# EAGLE design AFM_QFM_input_patial (EAGLE 9.6.2)
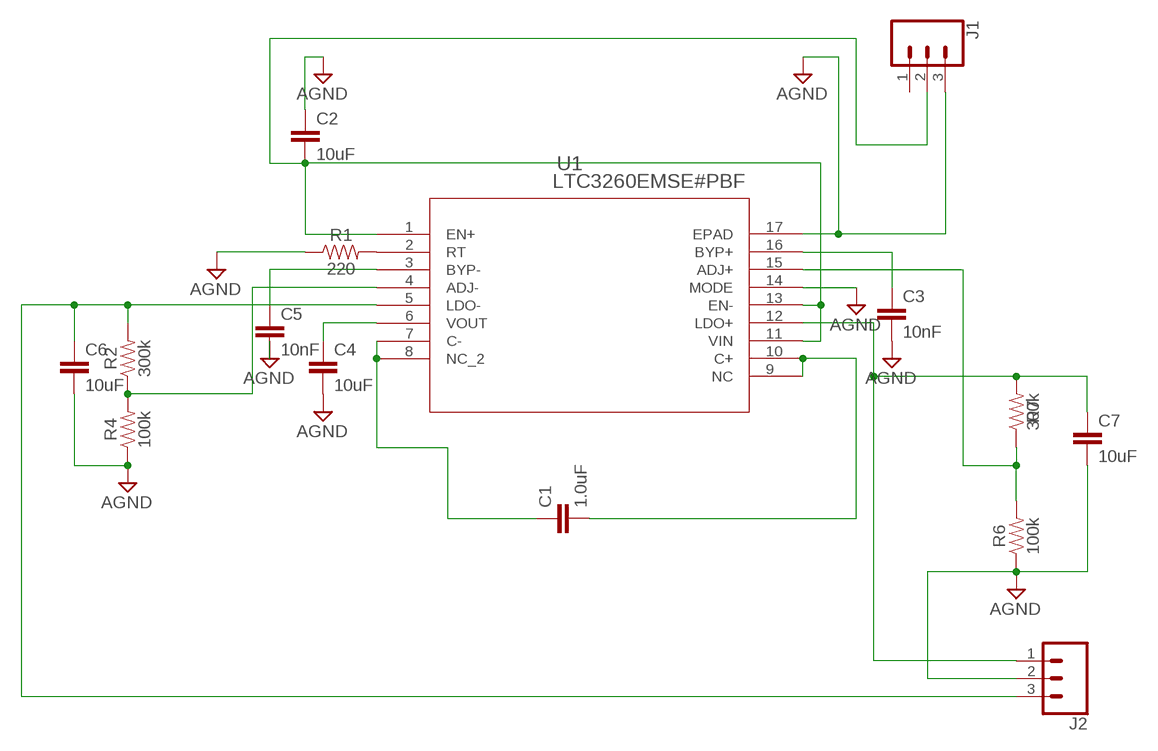
[diagram p0: schematic, sheet 1]

## Parts
C1  1.0uF  1.0UF-0805-25V-(+80/-20%)  [0805]
C2  10uF  10UF-0805-25V-10%  [0805]
C3  10nF  10NF-0603-50V-10%  [0603]
C4  10uF  10UF-0805-25V-10%  [0805]
C5  10nF  10NF-0603-50V-10%  [0603]
C6  10uF  10UF-0805-25V-10%  [0805]
C7  10uF  10UF-0805-25V-10%  [0805]
J1  CONN_03LONGPADS  [1X03_LONGPADS]
J2  CONN_03LONGPADS  [1X03_LONGPADS]
R1  220  220OHM-0603-1/10W-1%  [0603]
R2  300k  300KOHM-0603-1/10W-1%  [0603]
R4  100k  100KOHM-0603-1/10W-1%  [0603]
R6  100k  100KOHM-0603-1/10W-1%  [0603]
R7  300k  300KOHM-0603-1/10W-1%  [0603]
U1  LTC3260EMSE#PBF  [MSOP-16_MSE]

## Nets
AGND: C2.1 C3.2 C4.2 C5.2 C6.2 C7.2 J1.3 J2.2 R1.1 R4.1 R6.1 U1.14(MODE) U1.17(EPAD)
N$1: C5.1 U1.3(BYP-)
N$2: R1.2 U1.2(RT)
N$3: C1.1 U1.7(C-) U1.8(NC_2)
N$4: C1.2 U1.9(NC) U1.10(C+)
N$5: C2.2 J1.2 U1.1(EN+) U1.11(VIN) U1.13(EN-)
N$6: C3.1 U1.16(BYP+)
N$7: C4.1 U1.6(VOUT)
N$8: R2.1 R4.2 U1.4(ADJ-)
N$10: C6.1 J2.3 R2.2 U1.5(LDO-)
N$12: R6.2 R7.1 U1.15(ADJ+)
N$13: C7.1 J2.1 R7.2 U1.12(LDO+)
Unconnected: J1.1

## Library data of the parts
C1 = SparkFun-Capacitors:1.0UF: 1µF ceramic capacitors A capacitor is a passive two-terminal electrical component used to store electrical energy temporarily in an electric field.; PROD_ID: CAP-11625
C2 C4 C6 C7 = SparkFun-Capacitors:10UF: 10.0µF ceramic capacitors A capacitor is a passive two-terminal electrical component used to store electrical energy temporarily in an electric field.; PROD_ID: CAP-14259
C3 C5 = SparkFun-Capacitors:10NF: 0.01uF/10nF/10,000pF ceramic capacitors A capacitor is a passive two-terminal electrical component used to store electrical energy temporarily in an electric field. CAP-09321; PROD_ID: CAP-00867
J1 J2 = SparkFun-Connectors:CONN_03: Multi connection point. Often used as Generic Header-pin footprint for 0.1 inch spaced/style header connections On any of the 0.1 inch spaced packages, you can populate with these: Break Away Headers - Straight <https://www.sparkfun.com/products/116> (PRT-00116) Break Away Male Headers - Right Angle <https://www.sparkfun.com/products/553> (PRT-00553) Female Headers <https://www.sparkfun.com/products/115> (PRT-00115) Break Away Headers - Machine Pin <https://www.sparkfun.com/products/117> (PRT-00117) Break Away Female Headers - Swiss Machine Pin <https://www.sparkfun.com/products/743> (PRT-00743) Stackable Header - 3 Pin (Female, 0.1") <https://www.sparkfun.com/products/13875> (PRT-13875) For SCREWTERMINALS and SPRING TERMINALS visit here: Screw Terimnals on SparkFun.com <https://www.sparkfun.com/search/results?term=Screw+Terminals> (5mm/3.5mm/2.54mm spacing) This device is also useful as a general connection point to wire up your design to another part of your project. Our various solder wires solder well into these plated through hole pads. Hook-Up Wire - Assortment (Stranded, 22 AWG) <https://www.sparkfun.com/products/11375> (PRT-11375) Hook-Up Wire - Assortment (Solid Core, 22 AWG) <https://www.sparkfun.com/products/11367> (PRT-11367) View the entire wire category on our website here <https://www.sparkfun.com/categories/141> Special notes: Molex polarized connector foot print use with SKU : PRT-08232 with associated crimp pins and housings.
R1 = SparkFun-Resistors:220OHM: 220Ω resistor A resistor is a passive two-terminal electrical component that implements electrical resistance as a circuit element. Resistors act to reduce current flow, and, at the same time, act to lower voltage levels within circuits. - Wikipedia; PROD_ID: RES-07861
R2 R7 = SparkFun-Resistors:300KOHM: 300kΩ resistor A resistor is a passive two-terminal electrical component that implements electrical resistance as a circuit element. Resistors act to reduce current flow, and, at the same time, act to lower voltage levels within circuits. - Wikipedia; PROD_ID: RES-10809
R4 R6 = SparkFun-Resistors:100KOHM: 100kΩ resistor A resistor is a passive two-terminal electrical component that implements electrical resistance as a circuit element. Resistors act to reduce current flow, and, at the same time, act to lower voltage levels within circuits. - Wikipedia; PROD_ID: RES-07828
U1 = LTC3260EMSE_PBF (1):LTC3260EMSE#PBF: Check availability <https://pricing.snapeda.com/parts/LTC3260EMSE%23PBF/Analog%20Devices/view-part?ref=eda>; AVAILABILITY: In Stock; CHECK_PRICES: https://www.snapeda.com/parts/LTC3260EMSE%23PBF/Analog+Devices/view-part/?ref=eda; DESCRIPTION: Low Noise Dual Supply Inverting Charge Pump; MF: Analog Devices; MP: LTC3260EMSE#PBF; PACKAGE: MSOP -16 Analog Devices; PRICE: None; PURCHASE-URL: https://www.snapeda.com/api/url_track_click_mouser/?unipart_id=4339513&manufacturer=Analog Devices&part_name=LTC3260EMSE#PBF&search_term=None; SNAPEDA_LINK: https://www.snapeda.com/parts/LTC3260EMSE%23PBF/Analog+Devices/view-part/?ref=snap

## Board
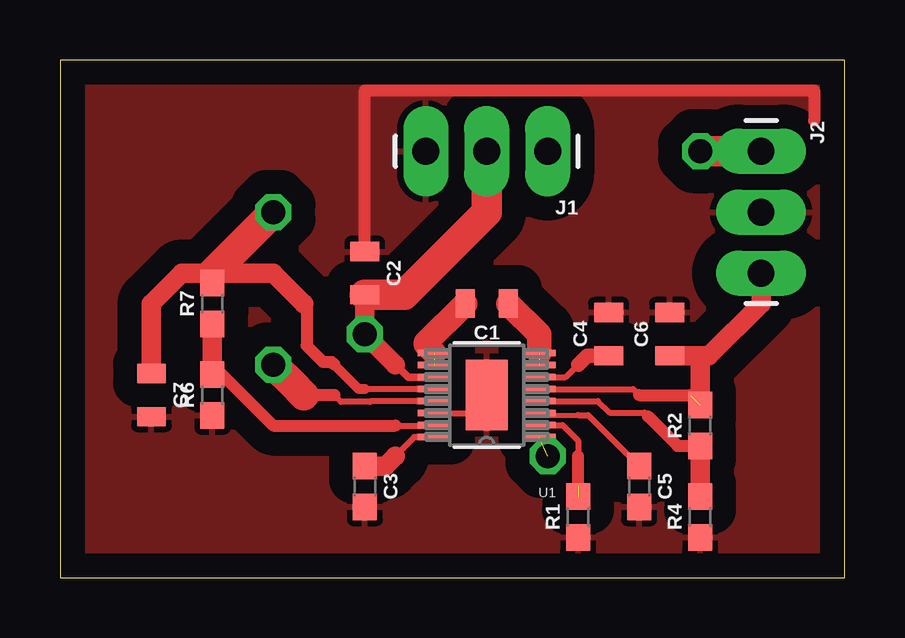
[diagram p1: board, top side]
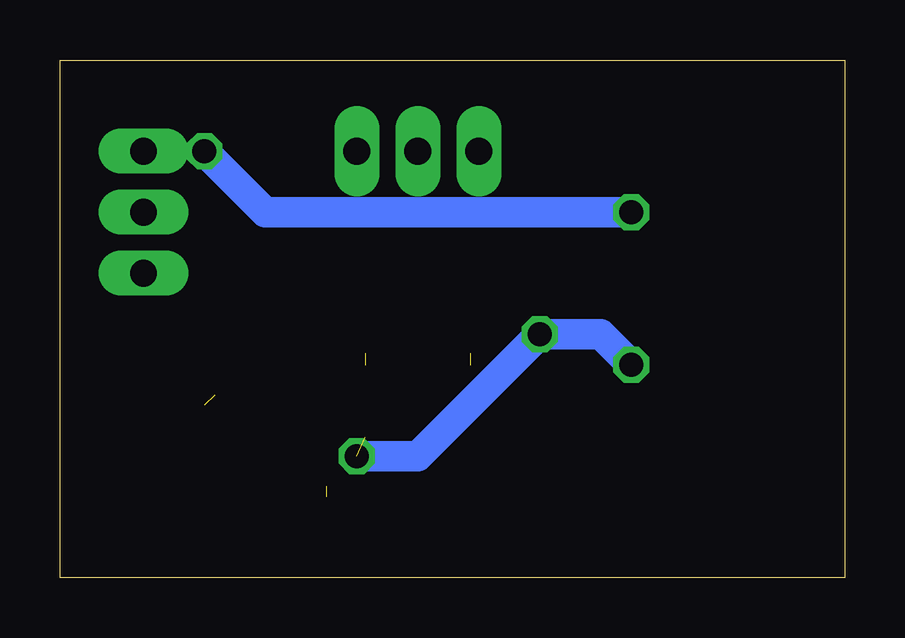
[diagram p2: board, bottom side, seen from below]

Size 32.69 x 21.58 mm. Coordinates in mm from the lower left corner, seen from the top.
Outline: 0,0 32.69,0 32.69,21.58 0,21.58 0,0
Copper layers (1*16): Top 0.035mm / dielectric 1.5mm / Bottom 0.035mm
Design rules "default": minimum track width 6mil, minimum drill 0.35mm, track to track 6mil, track to pad 6mil, pad to pad 6mil, via to via 6mil, smd to smd 6mil, copper to edge 40mil, drill to drill 6mil, minimum pad ring 10mil, minimum via ring 8mil, stop-mask expansion 4mil, vias tented up to drill 0mil, thermal gap 10mil

### Footprints (pad centres in the part's own frame; a part is rotated, then mirrored left to right if it is on the bottom)
0805 = smd 0.8 x 1.2: 1 -0.9,0; 2 0.9,0
0603 = smd 1.1 x 1: 1 -0.85,0; 2 0.85,0
1X03_LONGPADS = drill 1.118 pad 1.88 long: 1 0,0; 2 2.54,0; 3 5.08,0
MSOP-16_MSE = smd 1.397 x 0.279: 1 -2.184,1.751; 2 -2.184,1.251; 3 -2.184,0.751; 4 -2.184,0.25; 5 -2.184,-0.25; 6 -2.184,-0.751; 7 -2.184,-1.251; 8 -2.184,-1.751; 9 2.184,-1.751; 10 2.184,-1.251; 11 2.184,-0.751; 12 2.184,-0.25; 13 2.184,0.25; 14 2.184,0.751; 15 2.184,1.251; 16 2.184,1.751 | smd 1.753 x 2.946: 17 0,0

### Placement (x,y rotation side)
C1  17.78,11.43 180 top
C2  12.7,12.7 270 top
C3  12.7,3.81 270 top
C4  22.86,10.16 90 top
C5  24.13,3.81 270 top
C6  25.4,10.16 90 top
C7  3.81,7.62 270 top
J1  20.32,17.78 180 top
J2  29.21,17.78 270 top
R1  21.59,2.54 90 top
R2  26.67,6.35 90 top
R4  26.67,2.54 90 top
R6  6.35,7.62 90 top
R7  6.35,11.43 90 top
U1  17.78,7.62 180 top

### Tracks (layer width: path | path; a pad name or v marks a point on that pad's centre or on a via)
AGND
  Top 0.254: U1.14 17.26,6.87 17.78,6.35
  Top 0.5: U1.17 17.78,6.35 | C2.1 12.7,20.31 31.42,20.31 31.42,19.05
  pour Top (isolate 1): 0,21.59 0,0 33.02,0 33.02,21.59
N$1
  Top 0.2: U1.3 20.05,6.79 21.59,6.79
  Top 0.254: C5.1 22,6.79 21.59,6.79
N$2  (1 unrouted)
  Top 0.254: U1.2 20.94,6.37 21.59,5.72 21.59,5.08
  Top 0.508: 21.59,3.81 21.59,5.08
N$3  (1 unrouted)
  Top 1.016: C1.1 19.96,10.15 U1.8
N$4  (1 unrouted)
  Top 1.016: C1.2 15.24,9.79 15.24,9.73 U1.9
N$5  (via drill 1)  (1 unrouted)
  Top 0.254: U1.13 12.95,7.37 12.92,7.34 11.71,7.34 11.43,7.62
  Top 0.305: U1.11 15.58,8.36 14.5,8.36 13.97,8.89
  Top 0.508: 11.43,7.62 10.16,7.62
  Top 0.813: 13.97,8.89 v12.7,10.16 C2.2 | 9.98,7.8 9.81,7.96
  Top 1.27: J1.2 17.78,15.24 14.34,11.8 C2.2 | 9.98,7.8 10.16,7.62 | 9.81,7.96 v8.89,8.89
  Bottom 1.27: v8.89,8.89 10.16,10.16 v12.7,10.16 17.78,5.08 v20.32,5.08
N$6
  Top 0.254: U1.16 14.76,5.87 13.97,5.08
  Top 0.813: 13.97,5.08 13.55,4.66 C3.1
N$7
  Top 0.254: U1.6 21.07,8.37 21.59,8.89
  Top 0.61: 21.59,8.89 21.96,9.26 C4.1
N$8
  Top 0.254: 24.51,6.73 24.35,6.88 22.9,6.88 22.41,7.37 U1.4
  Top 0.508: 24.51,6.73 25.73,5.5 R2.1
  Top 0.813: R2.1 R4.2
N$10  (1 unrouted)
  Top 0.254: U1.5 23.88,7.87 24.13,7.62
  Top 0.508: 24.13,7.62 26.25,7.62
  Top 0.813: C6.1 26.67,9.26 | 26.67,9.26 27.04,9.26 29.21,11.43 J2.3 | R2.2 26.67,9.26
N$12
  Top 0.254: U1.15 15.58,6.35 13.97,6.35
  Top 0.5: 6.35,8.89 8.89,6.35 13.97,6.35
  Top 0.813: R7.1 6.35,8.89 R6.2
N$13  (via drill 1)
  Top 0.254: U1.12 12.7,7.87
  Top 0.406: 12.7,7.87 12.45,7.87 11.43,8.89
  Top 0.508: 10.16,11.43 10.27,11.32 10.27,9.68 10.95,9 11.32,9 11.43,8.89
  Top 0.813: C7.1 3.81,11.43 5.08,12.7 6.35,12.7 | 6.35,12.7 8.89,12.7 10.16,11.43 | R7.2 6.35,12.7
  Top 1.27: J2.1 v26.67,17.78 | 6.35,12.7 v8.89,15.24
  Bottom 1.27: v26.67,17.78 24.13,15.24 v8.89,15.24